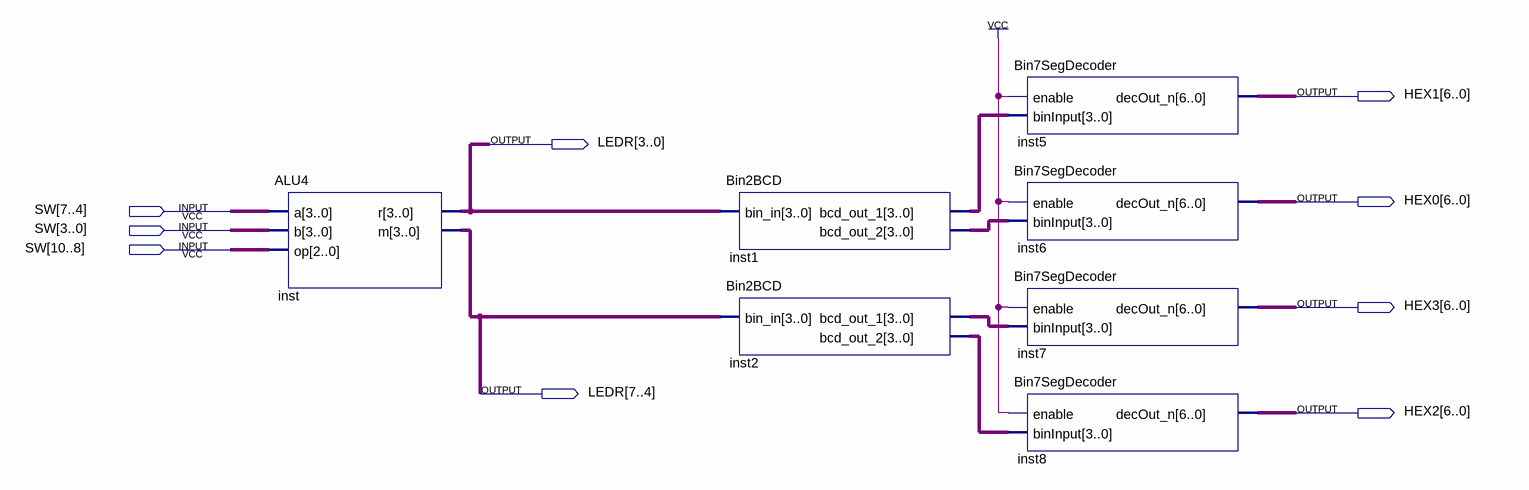
[diagram p0: schematic sheet]
// Quartus schematic ALUDemo.bdf as structural Verilog: 7 symbols, 9 pins
module ALUDemo (
  input  [10:0] SW,
  output [6:0] HEX1,
  output [7:0] LEDR,
  output [6:0] HEX0,
  output [6:0] HEX3,
  output [6:0] HEX2
);

  wire [3:0] inst1_bcd_out_1, inst1_bcd_out_2, inst2_bcd_out_1, inst2_bcd_out_2;

  ALU4 inst (.a(SW[7:4]), .b(SW[3:0]), .op(SW[10:8]), .r(LEDR[3:0]), .m(LEDR[7:4]));
  Bin2BCD inst1 (.bin_in(LEDR[3:0]), .bcd_out_1(inst1_bcd_out_1), .bcd_out_2(inst1_bcd_out_2));
  Bin2BCD inst2 (.bin_in(LEDR[7:4]), .bcd_out_1(inst2_bcd_out_1), .bcd_out_2(inst2_bcd_out_2));
  Bin7SegDecoder inst5 (.enable(1'b1), .binInput(inst1_bcd_out_1), .decOut_n(HEX1));
  Bin7SegDecoder inst6 (.enable(1'b1), .binInput(inst1_bcd_out_2), .decOut_n(HEX0));
  Bin7SegDecoder inst7 (.enable(1'b1), .binInput(inst2_bcd_out_1), .decOut_n(HEX3));
  Bin7SegDecoder inst8 (.enable(1'b1), .binInput(inst2_bcd_out_2), .decOut_n(HEX2));
endmodule
